# EAGLE design OSSISolarY (EAGLE 6.1)
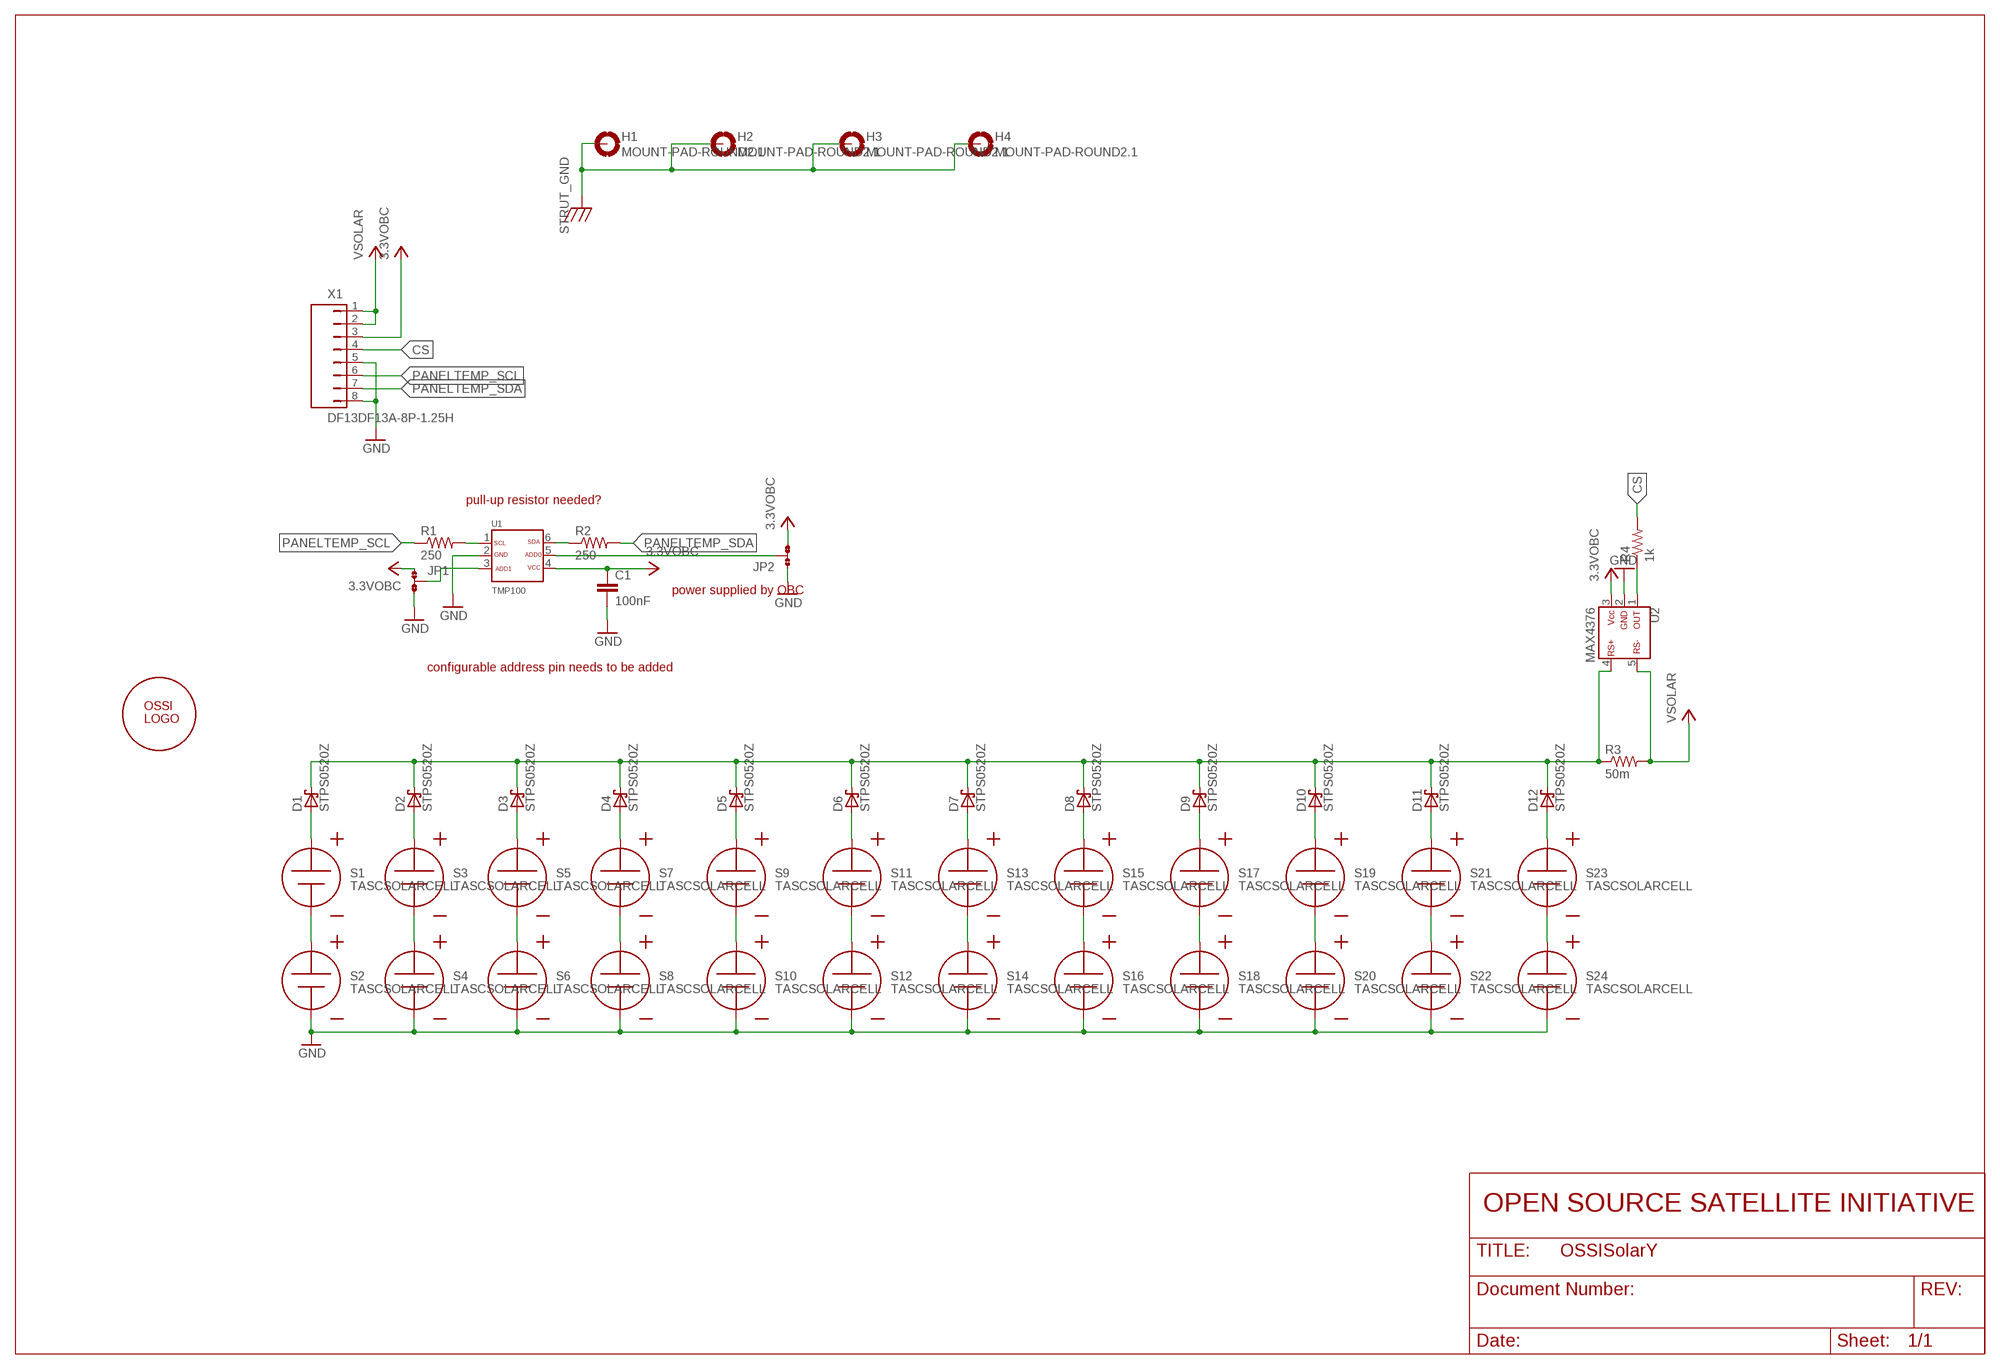
[diagram p0: schematic, sheet 1]

## Parts
C1  100nF  C0603(1608)  [C0603(1608)]
D1  STPS0520Z  [SOD-123]
D2  STPS0520Z  [SOD-123]
D3  STPS0520Z  [SOD-123]
D4  STPS0520Z  [SOD-123]
D5  STPS0520Z  [SOD-123]
D6  STPS0520Z  [SOD-123]
D7  STPS0520Z  [SOD-123]
D8  STPS0520Z  [SOD-123]
D9  STPS0520Z  [SOD-123]
D10  STPS0520Z  [SOD-123]
D11  STPS0520Z  [SOD-123]
D12  STPS0520Z  [SOD-123]
H1  MOUNT-PAD-ROUND2.1  [2.1-PAD-ROUND]
H2  MOUNT-PAD-ROUND2.1  [2.1-PAD-ROUND]
H3  MOUNT-PAD-ROUND2.1  [2.1-PAD-ROUND]
H4  MOUNT-PAD-ROUND2.1  [2.1-PAD-ROUND]
JP1  JP2  [JP2SMD0603]
JP2  JP2  [JP2SMD0603]
R1  250  R0603(1608)  [R0603(1608)]
R2  250  R0603(1608)  [R0603(1608)]
R3  50m  RWSL1206  [WSL1206]
R4  1k  R0603(1608)  [R0603(1608)]
S1  TASCSOLARCELL  [TASCSOLARCELL]
S2  TASCSOLARCELL  [TASCSOLARCELL]
S3  TASCSOLARCELL  [TASCSOLARCELL]
S4  TASCSOLARCELL  [TASCSOLARCELL]
S5  TASCSOLARCELL  [TASCSOLARCELL]
S6  TASCSOLARCELL  [TASCSOLARCELL]
S7  TASCSOLARCELL  [TASCSOLARCELL]
S8  TASCSOLARCELL  [TASCSOLARCELL]
S9  TASCSOLARCELL  [TASCSOLARCELL]
S10  TASCSOLARCELL  [TASCSOLARCELL]
S11  TASCSOLARCELL  [TASCSOLARCELL]
S12  TASCSOLARCELL  [TASCSOLARCELL]
S13  TASCSOLARCELL  [TASCSOLARCELL]
S14  TASCSOLARCELL  [TASCSOLARCELL]
S15  TASCSOLARCELL  [TASCSOLARCELL]
S16  TASCSOLARCELL  [TASCSOLARCELL]
S17  TASCSOLARCELL  [TASCSOLARCELL]
S18  TASCSOLARCELL  [TASCSOLARCELL]
S19  TASCSOLARCELL  [TASCSOLARCELL]
S20  TASCSOLARCELL  [TASCSOLARCELL]
S21  TASCSOLARCELL  [TASCSOLARCELL]
S22  TASCSOLARCELL  [TASCSOLARCELL]
S23  TASCSOLARCELL  [TASCSOLARCELL]
S24  TASCSOLARCELL  [TASCSOLARCELL]
U1  TMP100  [SOT23-6DBV]
U2  MAX4376  [SOT23-5DBV]
U$2  OSSILOGO  [OSSILOGORECT1005]
X1  DF13DF13A-8P-1.25H  [DF13A-8P]

## Nets
3.3VOBC: C1.1 JP1.1 JP2.3 U1.4 U2.3 X1.3
CS: R4.2 X1.4
GND: C1.2 JP1.3 JP2.1 S2.N S4.N S6.N S8.N S10.N S12.N S14.N S16.N S18.N S20.N S22.N S24.N U1.2 U2.2 X1.5 X1.8
N$1: S1.N S2.P
N$2: D1.A S1.P
N$3: S3.N S4.P
N$4: D2.A S3.P
N$5: S5.N S6.P
N$6: D3.A S5.P
N$7: S7.N S8.P
N$8: D4.A S7.P
N$9: S9.N S10.P
N$10: D5.A S9.P
N$11: S11.N S12.P
N$12: D6.A S11.P
N$13: S13.N S14.P
N$14: D7.A S13.P
N$15: S15.N S16.P
N$16: D8.A S15.P
N$17: S17.N S18.P
N$18: D9.A S17.P
N$19: S19.N S20.P
N$20: D10.A S19.P
N$21: S21.N S22.P
N$22: D11.A S21.P
N$23: S23.N S24.P
N$24: D12.A S23.P
N$25: R1.2 U1.1
N$26: R2.1 U1.6
N$27: D1.C D2.C D3.C D4.C D5.C D6.C D7.C D8.C D9.C D10.C D11.C D12.C R3.P$1 U2.4
N$28: JP1.2 U1.3
N$29: JP2.2 U1.5
N$30: R4.1 U2.1
PANELTEMP_SCL: R1.1 X1.6
PANELTEMP_SDA: R2.2 X1.7
STRUT_GND: H1.B3,2(MOUNT) H2.B3,2(MOUNT) H3.B3,2(MOUNT) H4.B3,2(MOUNT)
VSOLAR: R3.P$2 U2.5 X1.1 X1.2

## Notes on the sheet
- pull-up resistor needed?
- power supplied by OBC
- configurable address pin needs to be added
- OPEN SOURCE SATELLITE INITIATIVE

## Library data of the parts
C1 = OSSI:C
D1-D12 = OSSI:STPS0520Z: We use STPS0520Z by st.com diode for solar cell schottky diode. If = 500mA Vrrm = 20V Vf max = 0.32V
H1-H4 = OSSI:MOUNT-PAD-ROUND
JP1 JP2 = OSSI:JP2
R1-R4 = OSSI:R
S1-S24 = OSSI:TASCSOLARCELL
U1 = OSSI:TMP100: TMP100 Digital Temerature Sensor with I2C Interface from Texas Instruments
U2 = OSSI:MAX4376
U$2 = OSSI:OSSILOGO
X1 = OSSI:DF13: Hirose DF13 series connector

## Board
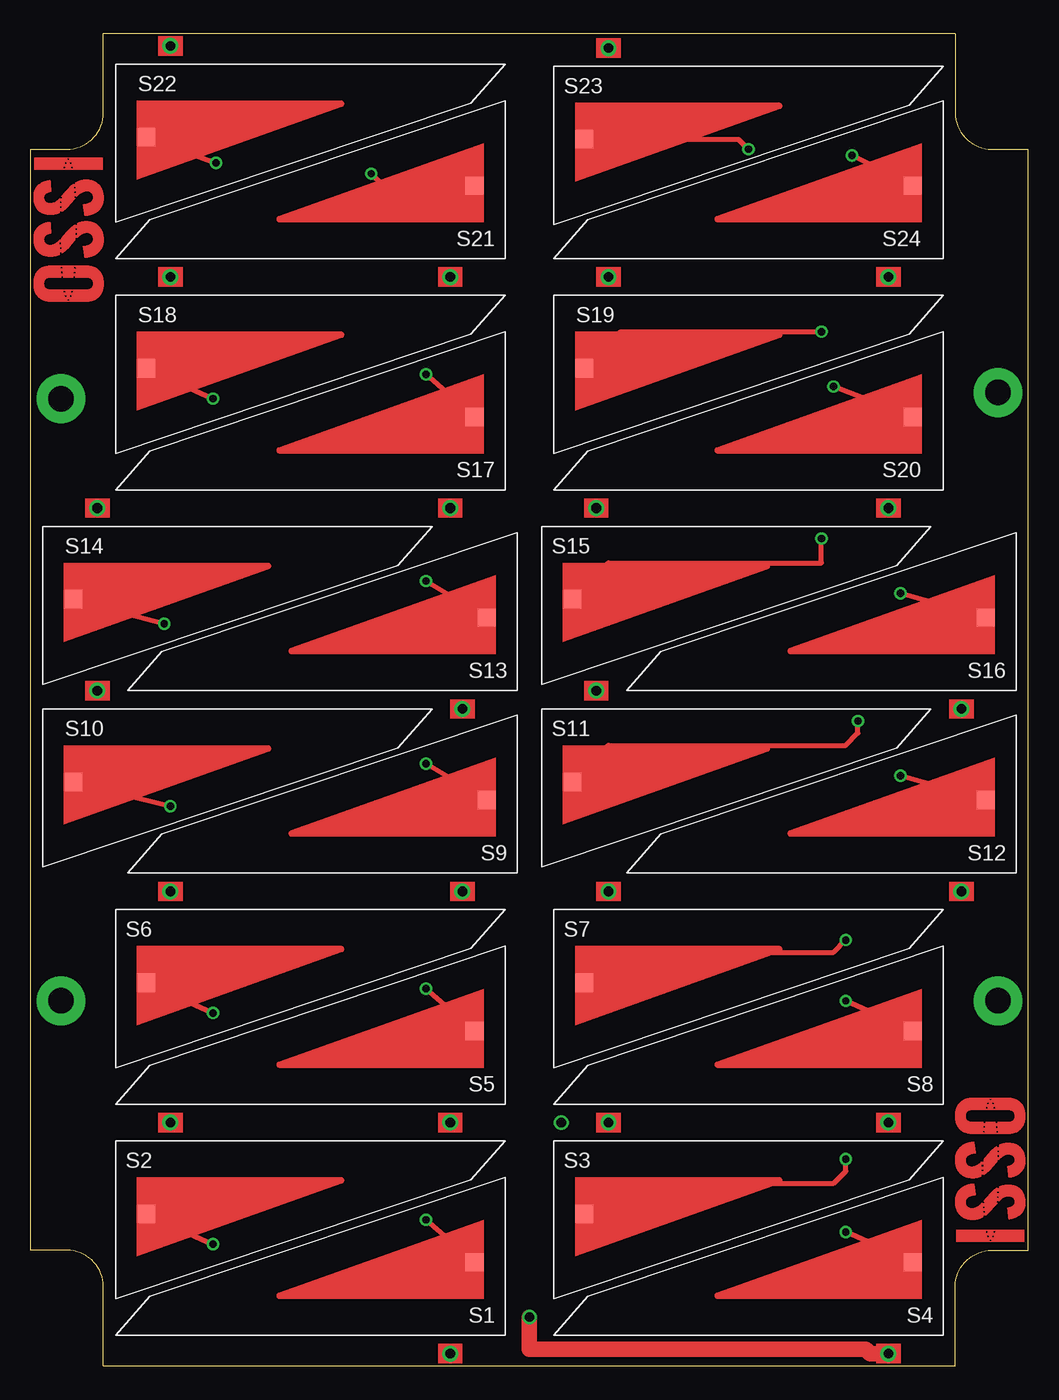
[diagram p1: board, top side]
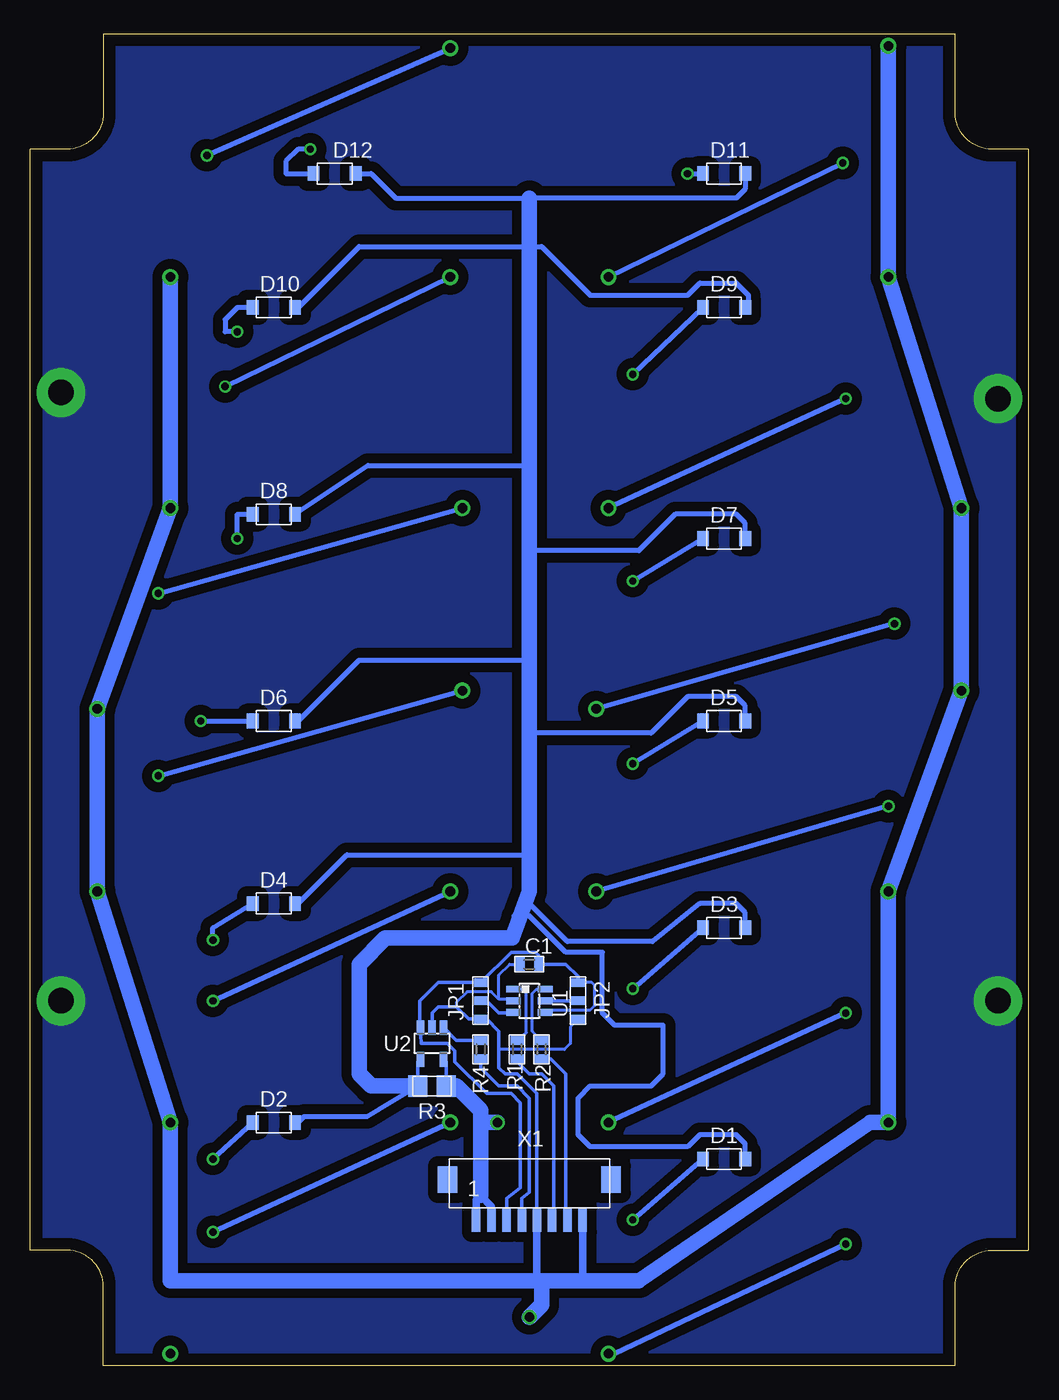
[diagram p2: board, bottom side, seen from below]

Size 82 x 109.5 mm. Coordinates in mm from the lower left corner, seen from the top.
Outline: 6,0 76,0 76,6.5 arc-90 79,9.5 82,9.5 82,100 79,100 arc-90 76,103 76,109.5 6,109.5 6,103 arc-90 3,100 0,100 0,9.5 3,9.5 arc-90 6,6.5 6,0
Copper layers (1*16): Top 0.035mm / dielectric 1.5mm / Bottom 0.035mm
Design rules "default": minimum track width 10mil, minimum drill 24mil, track to track 8mil, track to pad 8mil, pad to pad 8mil, via to via 8mil, smd to smd 8mil, copper to edge 40mil, drill to drill 8mil, minimum pad ring 10mil, minimum via ring 8mil, stop-mask expansion 4mil, vias tented up to drill 0mil, thermal gap 10mil

### Footprints (pad centres in the part's own frame; a part is rotated, then mirrored left to right if it is on the bottom)
C0603(1608) = smd 0.7 x 1.1: 1 -0.75,0; 2 0.75,0
SOD-123 = smd 0.97 x 1.2: A -1.735,0; C 1.735,0
2.1-PAD-ROUND = drill 2.1 pad 4: B3,2 0,0
JP2SMD0603 = smd 0.7 x 1.1: 1 -1.5,0; 2 0,0; 3 1.5,0
R0603(1608) = smd 0.7 x 1.1: 1 -0.75,0; 2 0.75,0
WSL1206 = smd 1.57 x 1.78: P$1 -1.165,0; P$2 1.165,0
TASCSOLARCELL = drill 0.8: N -4.5,-1.5 | smd 1.5 x 1.5: P -2.5,6
SOT23-6DBV = smd 0.55 x 1.2: 1 -0.95,-1.3; 2 0,-1.3; 3 0.95,-1.3; 4 0.95,1.3; 5 0,1.3; 6 -0.95,1.3
SOT23-5DBV = smd 0.6 x 1.22: 1 -0.95,-1.3; 2 0,-1.3; 3 0.95,-1.3; 4 0.95,1.3; 5 -0.95,1.3
DF13A-8P = smd 0.7 x 2: 1 -4.375,0; 2 -3.125,0; 3 -1.875,0; 4 -0.625,0; 5 0.625,0; 6 1.875,0; 7 3.125,0; 8 4.375,0 | smd 1.6 x 2.2: P$1 -6.725,3.3; P$2 6.725,3.3

### Placement (x,y rotation side)
C1  41,33 180 bottom
D1  25,17 0 bottom
D2  62,20 0 bottom
D3  25,36 0 bottom
D4  62,38 0 bottom
D5  25,53 0 bottom
D6  62,53 0 bottom
D7  25,68 0 bottom
D8  62,70 0 bottom
D9  25,87 0 bottom
D10  62,87 0 bottom
D11  25,98 0 bottom
D12  57,98 0 bottom
H1  2.5,30 0 top
H2  79.5,30 0 top
H3  2.5,79.5 0 top
H4  79.5,80 0 top
JP1  45,30 270 bottom
JP2  37,30 90 bottom
R1  42,26 90 bottom
R2  40,26 270 bottom
R3  49,23 0 bottom
R4  45,26 270 bottom
S1  39,2.5 0 top
S2  7,18.5 180 top
S3  43,18.5 180 top
S4  75,2.5 0 top
S5  39,21.5 0 top
S6  7,37.5 180 top
S7  43,37.5 180 top
S8  75,21.5 0 top
S9  40,40.5 0 top
S10  1,54 180 top
S11  42,54 180 top
S12  81,40.5 0 top
S13  40,55.5 0 top
S14  1,69 180 top
S15  42,69 180 top
S16  81,55.5 0 top
S17  39,72 0 top
S18  7,88 180 top
S19  43,88 180 top
S20  75,72 0 top
S21  39,91 0 top
S22  7,107 180 top
S23  43,106.82 180 top
S24  75,91 0 top
U1  41,30 270 bottom
U2  49,26.5 180 bottom
U$1  OSSILOGO  [OSSILOGORECT1005]  76,22 270 top
U$2  6,87.5 90 top
X1  41,12 0 bottom

### Tracks (layer width: path | path; a pad name or v marks a point on that pad's centre or on a via)
3.3VOBC
  Bottom 0.254: U1.4 39.5,29.25 36,29.25 35.62,29.62 35.62,31.25 35.88,31.5 JP2.3
  Bottom 0.305: X1.3 42.88,13.75 41.75,14.62 41.75,21.62 42.5,22.38 44.5,22.38 47.12,25 47.12,25.88 47.75,26.5 49.9,26.5 U2.3 50,27.85 50,30 48.5,31.5 JP1.1 42.5,34 40.5,34 40.25,33.75 C1.1 38,33 37,32 JP2.3
CS
  Bottom 0.305: X1.4 41.62,13.75 41,14.25 41,22 42,23 43.5,23 45,24.5 R4.2
GND  (via drill 0.8)
  Top 1.27: S4.N 69,1 68.62,1.38 41,1.38 v41,4
  Bottom 0.254: JP2.1 37.62,27.88 37.62,26.5 38.12,26 43.5,26 | 43.5,30.12 43.5,32.12 42.62,33 C1.2 | U1.2 42.42,30.12 43.5,30.12 | 43.5,30.12 44.12,30.75 46.12,30.75 47,29.88 47,29.5
  Bottom 0.305: X1.5 40.38,13.12 40.38,22.38 42,24 43,24 43.5,24.5 43.5,26 43.5,27.5 44.5,28.5 JP1.3 46,28.5 | U2.2 | U2.2 49,29 48.5,29.5 47,29.5 46,28.5 | 46,28.5
  Bottom 0.61: X1.8 36.62,7.38 37,7 | X1.5 40.38,7.38 40,7
  Bottom 1.27: S22.N S18.N S14.N S10.N S6.N S2.N 13,20 32,7 37,7 40,7 | S24.N S20.N S16.N S12.N S8.N 70.5,7 40,7 | v41,4 40,5 40,7
N$1  (via drill 0.6)
  Top 0.406: S2.P v15,10
  Bottom 0.406: v15,10 34,1 S1.N
N$2  (via drill 0.6)
  Top 0.406: S1.P v32.5,12
  Bottom 0.406: v32.5,12 D1.A
N$3  (via drill 0.6)
  Top 0.406: S4.P v67,11
  Bottom 0.406: v67,11 S3.N
N$4  (via drill 0.6)
  Top 0.406: S3.P 48,15 66,15 67,16 v67,17
  Bottom 0.406: v67,17 D2.A
N$5  (via drill 0.6)
  Top 0.406: S6.P v15,29
  Bottom 0.406: v15,29 S5.N
N$6  (via drill 0.6)
  Top 0.406: S5.P v32.5,31
  Bottom 0.406: v32.5,31 D3.A
N$7  (via drill 0.6)
  Top 0.406: S8.P v67,30
  Bottom 0.406: v67,30 S7.N
N$8  (via drill 0.6)
  Top 0.406: S7.P 48,34 66,34 v67,35
  Bottom 0.406: v67,35 67,36 D4.A
N$9  (via drill 0.6)
  Top 0.406: S10.P v11.5,46
  Bottom 0.406: v11.5,46 S9.N
N$10  (via drill 0.6)
  Top 0.406: S9.P v32.5,49.5
  Bottom 0.406: v32.5,49.5 D5.A
N$11  (via drill 0.6)
  Top 0.406: S12.P v71.5,48.5
  Bottom 0.406: v71.5,48.5 S11.N
N$12  (via drill 0.6)
  Top 0.406: S11.P 47.5,51 67,51 68,52 v68,53
  Bottom 0.406: v68,53 D6.A
N$13  (via drill 0.6)
  Top 0.406: S14.P v11,61
  Bottom 0.406: v11,61 S13.N
N$14  (via drill 0.6)
  Top 0.406: S13.P v32.5,64.5
  Bottom 0.406: v32.5,64.5 D7.A
N$15  (via drill 0.6)
  Top 0.406: S16.P v71.5,63.5
  Bottom 0.406: v71.5,63.5 S15.N
N$16  (via drill 0.6)
  Top 0.406: S15.P 47.5,66 65,66 v65,68
  Bottom 0.406: v65,68 65,70 D8.A
N$17  (via drill 0.6)
  Top 0.406: S18.P v15,79.5
  Bottom 0.406: v15,79.5 S17.N
N$18  (via drill 0.6)
  Top 0.406: S17.P v32.5,81.5
  Bottom 0.406: v32.5,81.5 D9.A
N$19  (via drill 0.6)
  Top 0.406: S20.P v66,80.5
  Bottom 0.406: v66,80.5 S19.N
N$20  (via drill 0.6)
  Top 0.406: S19.P 48.5,85 v65,85
  Bottom 0.406: D10.A 65,87 66,86 66,85 v65,85
N$21  (via drill 0.6)
  Top 0.406: S22.P v15.25,98.88
  Bottom 0.406: v15.25,98.88 S21.N
N$22  (via drill 0.6)
  Top 0.406: S21.P 29,97 v28,98
  Bottom 0.406: v28,98 D11.A
N$23  (via drill 0.6)
  Top 0.406: S24.P v67.5,99.5
  Bottom 0.406: v67.5,99.5 S23.N
N$24  (via drill 0.6)
  Top 0.406: S23.P 58.18,100.82 v59,100
  Bottom 0.406: v59,100 60,100 61,99 61,98 D12.A
N$25
  Bottom 0.254: R1.2 41.25,27.38 41.25,30.75 41.58,30.95 U1.1
N$26
  Bottom 0.254: R2.1 40.75,27.5 40.75,30.62 40.42,30.95 U1.6
N$27
  Bottom 0.305: U2.4 50.16,24.98 R3.P$1
  Bottom 0.406: D11.C 23.27,96.73 24,96 41,96 52,96 54,98 D12.C | D10.C 60,87 55,92 41,92 40,92 36,88 28,88 27,89 24,89 23,88 23,87 D9.C | D8.C 54.27,74 41,74 | D7.C 23.27,69.27 24,70 29,70 32,67 41,67 | D5.C 23.27,54.27 24,55 28,55 31,52 41,52 | D6.C 60,53 55,58 41,58 | D4.C 60.27,37.73 56,42 41,42 | D3.C 23.27,37.27 24,38 27,38 30.88,34.88 37.88,34.88 41,38 41,39 | D1.C 23.27,18.27 24,19 27,19 28,18 36,18 37,19 37,22 36,23 31,23 30,24 30,28 34,28 35,29 35,34 38,34 41,37 42.27,37 42.42,35.16 | D2.C 60.27,19.73 59.5,20.5 54.34,20.5 R3.P$1
  Bottom 1.27: 41,96 41,92 41,74 41,67 41,58 41,52 41,42 41,39 42.42,35.16 52.84,35.16 55,33 55,24 54,23 R3.P$1
N$28
  Bottom 0.305: U1.3 42.35,29 43.5,29 44.5,30 JP1.2
N$29
  Bottom 0.305: U1.5 JP2.2
N$30
  Bottom 0.305: U2.1 47,26.75 R4.1
PANELTEMP_SCL
  Bottom 0.305: X1.6 39,12.12 39,23 40,24 41,24 42,25 R1.1
PANELTEMP_SDA
  Bottom 0.305: X1.7 38,12.12 38,24 39.25,25.25 R2.2
STRUT_GND
  pour Bottom (isolate 0.813, no thermals): 0.25,109.5 82.25,109.5 82,0 0,0
VSOLAR  (via drill 0.8)
  Bottom 0.305: U2.5 47.84,24.98 R3.P$2
  Bottom 0.61: X1.2 44.12,13.12 45,14 45.38,13.62 X1.1
  Bottom 1.27: R3.P$2 47,23 45,21 45,20 | 45,20 45,14 | v43.62,20 45,20